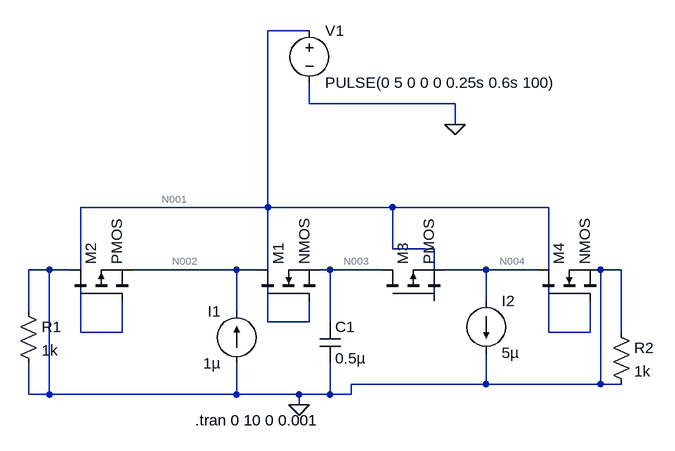
[diagram p0: schematic TriangleWave.asc]
* TriangleWave.asc
I1 0 N002 1µ
C1 N003 0 0.5µ
M1 N002 N001 N003 N003 NMOS
M2 0 N001 N002 N002 PMOS
R1 0 0 1k
I2 N004 0 5µ
R2 0 0 1k
V1 N001 0 PULSE(0 5 0 0 0 0.25s 0.6s 100)
M3 N003 N001 N004 N004 PMOS
M4 N004 N001 0 0 NMOS
.model NMOS NMOS
.model PMOS PMOS
.lib standard.mos
.tran 0 10 0 0.001
.backanno
.end

* Results of the author's LTspice run, read from the files saved beside the schematic
* Operating Point, zero values left out:
*   V(n002) = 303.5 mV
*   V(n003) = -88.7 mV
*   V(n004) = -499.4 mV
*   Id(M3) = 78.67 nA
*   Ib(M3) = -78.67 nA
*   Id(M2) = -921.3 nA
*   Is(M2) = 921.3 nA
*   Id(M4) = -4.921 µA
*   Ib(M4) = 2.427 µA
*   Is(M4) = 2.494 µA
*   Id(M1) = 78.67 nA
*   Is(M1) = -78.67 nA
*   I(I2) = 5 µA
*   I(I1) = 1 µA
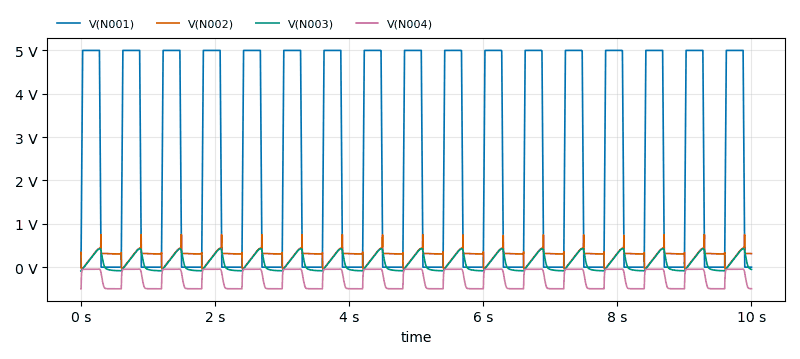
[diagram p1: Transient Analysis of TriangleWave.asc, plotted from the saved traces]
* Transient Analysis, 1 run:
*   V(N001): min -656.9 nV, max 5.001 V, average 2.337 V, rms 3.367 V, last 0 V
*   V(N002): min -45.93 mV, max 751.4 mV, average 265.7 mV, rms 296 mV, last 311.8 mV
*   V(N003): min -88.7 mV, max 426.7 mV, average 92.13 mV, rms 202.4 mV, last -52.88 mV
*   V(N004): min -499.4 mV, max -42.62 mV, average -260.7 mV, rms 337.4 mV, last -497.3 mV